# EasyEDA Pro project CH32V203C8T6采样模块.eprj, board PWM输出PCB
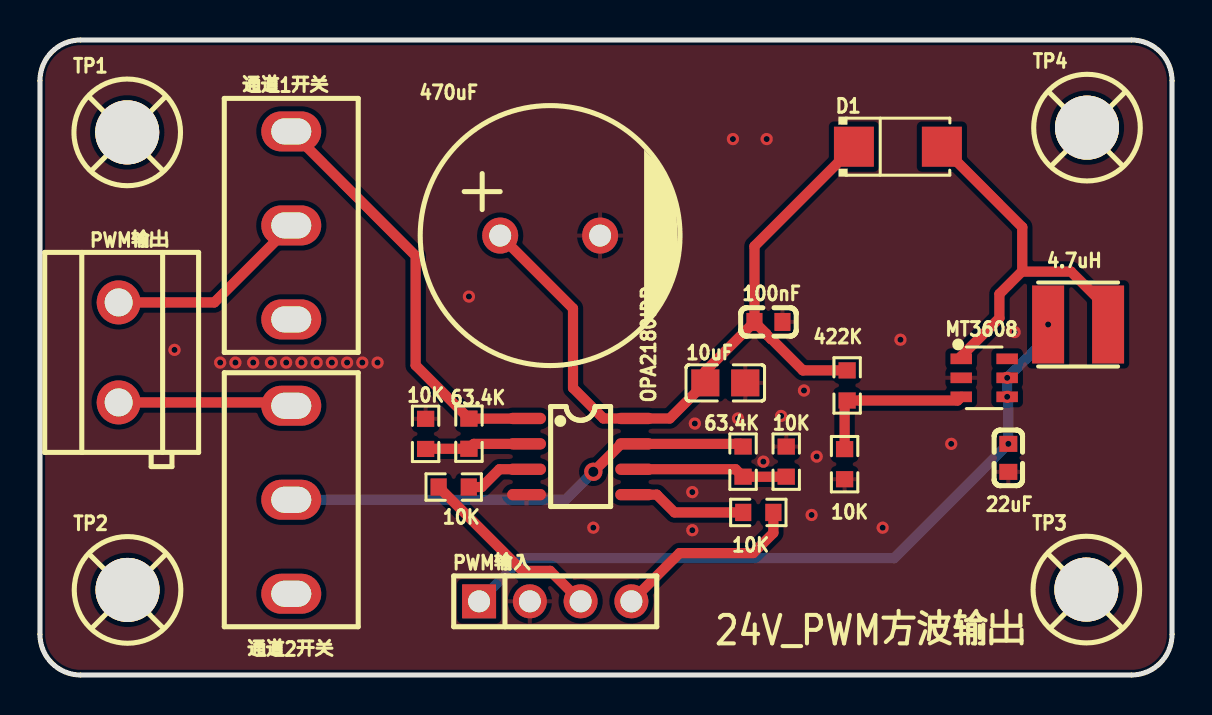
[diagram p7: board, top side]
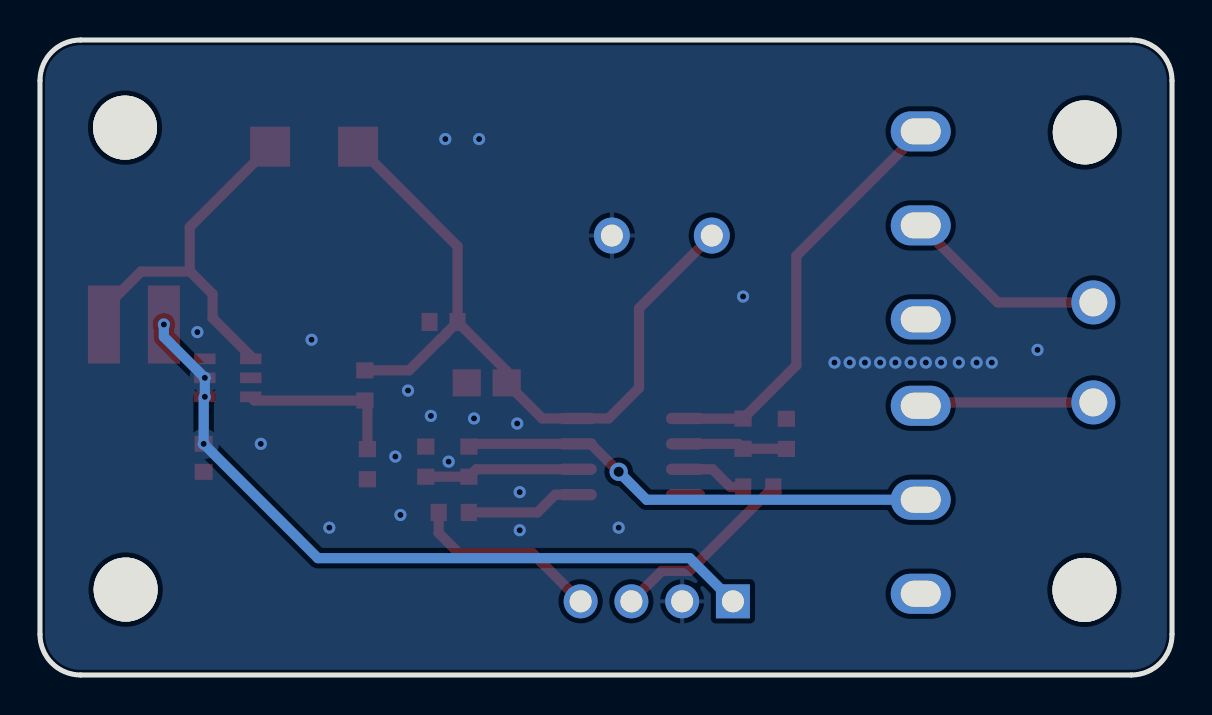
[diagram p8: board, bottom side, seen from below]

Outline 56.64 x 31.75 mm; copper layers: Top Layer, Bottom Layer. Coordinates in mm from the lower left corner of the outline.
Outline path: 0,29.72 0,2.03 arc(0.6,0.6) 2.03,0 54.61,0 arc(56.05,0.6) 56.64,2.03 56.64,29.72 arc(56.05,31.15) 54.61,31.75 2.03,31.75 arc(0.6,31.15) 0,29.72
Stack: Top Layer 0.035mm / Dielectric1 1.51mm FR4 er 4.5 / Bottom Layer 0.035mm

## Design rules (mm)
template: JLCPCB Capability(Two Layers Board)
spacing copperThickness1oz (default): track to track 0.102, other pairs 0.152 to 0.3
spacing copperThickness2oz: track to track 0.203, other pairs 0.152 to 0.3
track width copperThickness1oz (default): min 0.127, default 0.254, max 2.54
track width copperThickness2oz: min 0.203, default 0.254, max 2.54
differential pair differentialPair (default): width min 0.127, default 0.254, max 2.54; gap min 0.152, default 0.152
via viaSize (default): diameter min 0.5, default 0.61, max 10; hole min 0.3, default 0.305, max 6.3

## Placement (name value [footprint] x y rotation side)
4.7uH  4.7uH  [IND-SMD_L4.0-W4.0_FNR40XXS]  51.94 17.53 180 top
10K  -  [R0603]  35.94 8.13 0 top
10K#2  -  [R0603]  37.34 10.67 270 top
10K#3  -  [R0603]  20.7 9.4 0 top
10K#4  -  [R0603]  19.3 12.06 270 top
10K#5  -  [R0603]  40.26 10.54 90 top
10uF  10uF  [C0805]  34.29 14.61 0 top
22uF  22uF  [C0603]  48.45 10.86 90 top
63.4K  -  [R0603]  35.18 10.67 90 top
63.4K#2  -  [R0603]  21.46 12.06 90 top
100nF  100nF  [C0603]  36.45 17.65 180 top
422K  422kΩ  [R0603]  40.39 14.48 90 top
470uF  470uF  [CAP-TH_BD13.0-P5.00-D0.6-FD]  25.53 21.97 0 top
D1  SS34  [SMA_L4.3-W2.6-LS5.2-RD]  42.93 26.42 0 top
MT3608  MT3608  [SOT-23-6_L2.9-W1.6-P0.95-LS2.8-BL]  47.24 14.86 270 top
OPA2180IDR  OPA2180IDR  [SOIC-8_L5.0-W4.0-P1.27-LS6.0-BL]  27.05 10.92 270 top
PWM输入  PZ254V-11-04P  [HDR-TH_4P-P2.54-V-M]  25.78 3.68 0 top
PWM输出  KF301-5.0-2P  [CONN-TH_P5.00_KF301-5.0-2P]  3.94 16.13 270 top
TP1  -  [M3螺丝]  4.43 27.07 0 top
TP2  -  [M3螺丝]  4.45 4.19 0 top
TP3  -  [M3螺丝]  52.42 4.21 0 top
TP4  -  [M3螺丝]  52.45 27.3 0 top
通道1开关  SS-12D10L5  [SW-TH_SS-12D10L5]  12.57 22.48 90 top
通道2开关  SS-12D10L5  [SW-TH_SS-12D10L5]  12.57 8.76 90 top

## Footprints (pads in the part's own frame, mm; a bottom-side part is the same pattern mirrored in y, then rotated)
C0603
  rect 0.8x0.9 smd: 1(-0.7,0) 2(0.7,0)
C0805
  rect 1.41x1.35 smd: 1(-1,0) 2(1,0)
CAP-TH_BD13.0-P5.00-D0.6-FD
  round 1.8 hole 1.1: 1(-2.5,0) 2(2.5,0)
CONN-TH_P5.00_KF301-5.0-2P
  round 2.2 hole 1.4: 1(-2.5,0) 2(2.5,0)
HDR-TH_4P-P2.54-V-M
  rect 1.7x1.7 hole 1.1: 1(-3.81,0)
  round 1.7 hole 1.1: 2(-1.27,0) 3(1.27,0) 4(3.81,0)
IND-SMD_L4.0-W4.0_FNR40XXS
  rect 1.6x3.9 smd: 1(-1.5,0) 2(1.5,0)
M3螺丝
  round 3.2 hole 3.2: 1(-0.064,0.064)
R0603
  rect 0.806x0.864 smd: 1(-0.753,0) 2(0.753,0)
SMA_L4.3-W2.6-LS5.2-RD
  rect 2x2 smd: 1(-2.2,0) 2(2.2,0)
SOIC-8_L5.0-W4.0-P1.27-LS6.0-BL
  oval 0.569x1.95 smd: 1(-1.905,-2.705) 2(-0.635,-2.705) 3(0.635,-2.705) 4(1.905,-2.705) 5(1.905,2.705) 6(0.635,2.705) 7(-0.635,2.705) 8(-1.905,2.705)
SOT-23-6_L2.9-W1.6-P0.95-LS2.8-BL
  rect 0.532x1.072 smd: 1(-0.95,-1.149) 2(0,-1.149) 3(0.95,-1.149) 4(0.95,1.149) 5(0,1.149) 6(-0.95,1.149)
SW-TH_SS-12D10L5
  oval 2x3 hole 1.3x2: 1(-4.7,0) 2(0,0) 3(4.7,0)

## Nets
3V3: 4.7uH.2 22uF.2 MT3608.4 MT3608.5 PWM输入.1
+26V: 10uF.1 100nF.2 422K.2 470uF.1 D1.1 OPA2180IDR.8
GND: 10K#2.1 10K#4.1 10K#5.1 10uF.2 22uF.1 100nF.1 470uF.2 MT3608.2 OPA2180IDR.4 PWM输入.2
IN1: 10K#3.1 PWM输入.3
IN2: 10K.2 PWM输入.4
OUT1: 63.4K#2.2 OPA2180IDR.1 通道1开关.3
OUT2: 63.4K.2 OPA2180IDR.7 通道2开关.2
$1N979: 10K#2.2 63.4K.1 OPA2180IDR.6
$1N981: PWM输出.1 通道1开关.2
$1N982: PWM输出.2 通道2开关.3
$1N994: 10K#5.2 422K.1 MT3608.3
$1N999: 10K#4.2 63.4K#2.1 OPA2180IDR.2
$1N1000: 10K#3.2 OPA2180IDR.3
$1N1004: 4.7uH.1 D1.2 MT3608.1
$1N1008: 10K.1 OPA2180IDR.5

Pads without a net: MT3608 6; TP1 1; TP2 1; TP3 1; TP4 1; 通道1开关 1; 通道2开关 1

## Via types
v1: diameter 0.61, hole 0.305, Top Layer to Bottom Layer, 33 vias
v2: diameter 0.914, hole 0.508, Top Layer to Bottom Layer, 1 via

## Routing (per net, layer and track width the routed paths; a pad name or vN(x,y) marks a point on that pad's centre or on a via; arc(x,y) is an arc through that point)
3V3: length 36.6
  Bottom Layer w0.508: PWM输入.1 24.13,5.84 42.74,5.84 v1(48.45,11.56) 48.45,13.85 v1(48.39,13.91) v1(48.39,14.86) 50.44,16.91 v1(50.44,17.53)
+26V: length 37.7
  Top Layer w0.508: 422K.2 38.17,15.23 36.61,16.8 36.58,16.8 36.34,17.03 36.34,17.06 100nF.2 ; 100nF.2 35.75,21.44 D1.1 ; 100nF.2 33.29,15.19 10uF.1 31.51,12.83 OPA2180IDR.8 28.19,12.83 26.67,14.35 26.67,18.33 470uF.1
GND:
  vias: v1(6.73,16.26) v1(9.02,15.62) v1(9.78,15.62) v1(10.67,15.62) v1(11.56,15.62) v1(12.32,15.62) v1(13.08,15.62) v1(13.84,15.62) v1(14.61,15.62) v1(15.37,15.62) v1(16.13,15.62) v1(16.89,15.62) v1(21.46,18.92) v1(27.69,7.37) v1(32.64,9.14) v1(32.64,7.24) v1(32.77,12.57) v1(34.67,26.8) v1(34.92,12.83) v1(36.2,10.67) v1(36.36,26.8) v1(37.08,12.95) v1(38.23,14.22) v1(38.61,8) v1(38.86,10.92) v1(42.16,7.37) v1(43.05,16.76) v1(45.59,11.56) v1(48.77,17.14)
IN1: length 9.5
  Top Layer w0.508: 10K#3.1 24.14,5.21 25.53,5.21 PWM输入.3
IN2: length 9.5
  Top Layer w0.508: 10K.2 36.69,7.1 35.69,6.1 32,6.1 PWM输入.4
OUT1: length 20.9
  Top Layer w0.508: OPA2180IDR.1 24.34,12.82 63.4K#2.2 18.8,15.49 18.8,20.96 通道1开关.3
OUT2: length 23.8
  Top Layer w0.508: v2(27.69,10.16) 29.08,11.56 OPA2180IDR.7 35.04,11.56 63.4K.2
  Bottom Layer w0.508: 通道2开关.2 26.29,8.76 v2(27.69,10.16)
$1N979: length 7.7
  Top Layer w0.508: OPA2180IDR.6 34.81,10.29 63.4K.1 10K#2.2
$1N981: length 10.2
  Top Layer w0.508: 通道1开关.2 8.72,18.63 PWM输出.1
$1N982: length 8.7
  Top Layer w0.508: PWM输出.2 12.41,13.63 通道2开关.3
$1N994: length 8.3
  Top Layer w0.508: MT3608.3 45.91,13.72 422K.1 40.26,13.6 10K#5.2
$1N999: length 5.2
  Top Layer w0.508: OPA2180IDR.2 21.71,11.56 63.4K#2.1 19.3,11.31 10K#4.2
$1N1000: length 3.3
  Top Layer w0.508: 10K#3.2 22.1,9.4 22.99,10.29 OPA2180IDR.3
$1N1004: length 19.4
  Top Layer w0.508: 49.13,20.17 49.15,20.19 49.15,22.39 D1.2 ; 49.13,20.17 51.58,20.17 53.32,18.44 53.32,17.65 4.7uH.1 ; 49.13,20.17 48.01,19.05 48.01,17.85 46.1,15.94 MT3608.1
$1N1008: length 5.8
  Top Layer w0.508: 10K.1 31.75,8.13 30.86,9.02 OPA2180IDR.5

## Copper pours and planes (outline as drawn; the poured copper is in the pictures)
GND on Top Layer: -0.13,29.84 -0.12,30.02 -0.07,30.3 0.01,30.57 0.13,30.83 0.28,31.07 0.47,31.28 0.68,31.47 0.92,31.62 1.18,31.74 1.45,31.82 1.73,31.87 1.91,31.88 54.74,31.88 54.91,31.87 55.19,31.82 55.47,31.74 55.72,31.62 55.96,31.47 56.17,31.28 56.36,31.07 56.51,30.83 56.63,30.57 56.72,30.3 56.76,30.02 56.77,29.84 56.77,1.91 56.76,1.73 56.72,1.45 56.63,1.18 56.51,0.92 56.36,0.68 56.17,0.47 55.96,0.28 55.72,0.13 55.47,0.01 55.19,-0.07 54.91,-0.12 54.74,-0.13 1.91,-0.13 1.73,-0.12 1.45,-0.07 1.18,0.01 0.92,0.13 0.68,0.28 0.47,0.47 0.28,0.68 0.13,0.92 0.01,1.18 -0.07,1.45 -0.12,1.73 -0.13,1.91
GND on Bottom Layer: -0.13,29.84 -0.12,30.02 -0.07,30.3 0.01,30.57 0.13,30.83 0.28,31.07 0.47,31.28 0.68,31.47 0.92,31.62 1.18,31.74 1.45,31.82 1.73,31.87 1.91,31.88 54.74,31.88 54.91,31.87 55.19,31.82 55.47,31.74 55.72,31.62 55.96,31.47 56.17,31.28 56.36,31.07 56.51,30.83 56.63,30.57 56.72,30.3 56.76,30.02 56.77,29.84 56.77,1.91 56.76,1.73 56.72,1.45 56.63,1.18 56.51,0.92 56.36,0.68 56.17,0.47 55.96,0.28 55.72,0.13 55.47,0.01 55.19,-0.07 54.91,-0.12 54.74,-0.13 1.91,-0.13 1.73,-0.12 1.45,-0.07 1.18,0.01 0.92,0.13 0.68,0.28 0.47,0.47 0.28,0.68 0.13,0.92 0.01,1.18 -0.07,1.45 -0.12,1.73 -0.13,1.91

## Text on the board
Top Silkscreen Layer: 24V_PWM方波输出
